# EAGLE design AST2002 (EAGLE 6.3)
DATABASE: ./../../../../../Components/TinyCircuits_Part_Database.txt
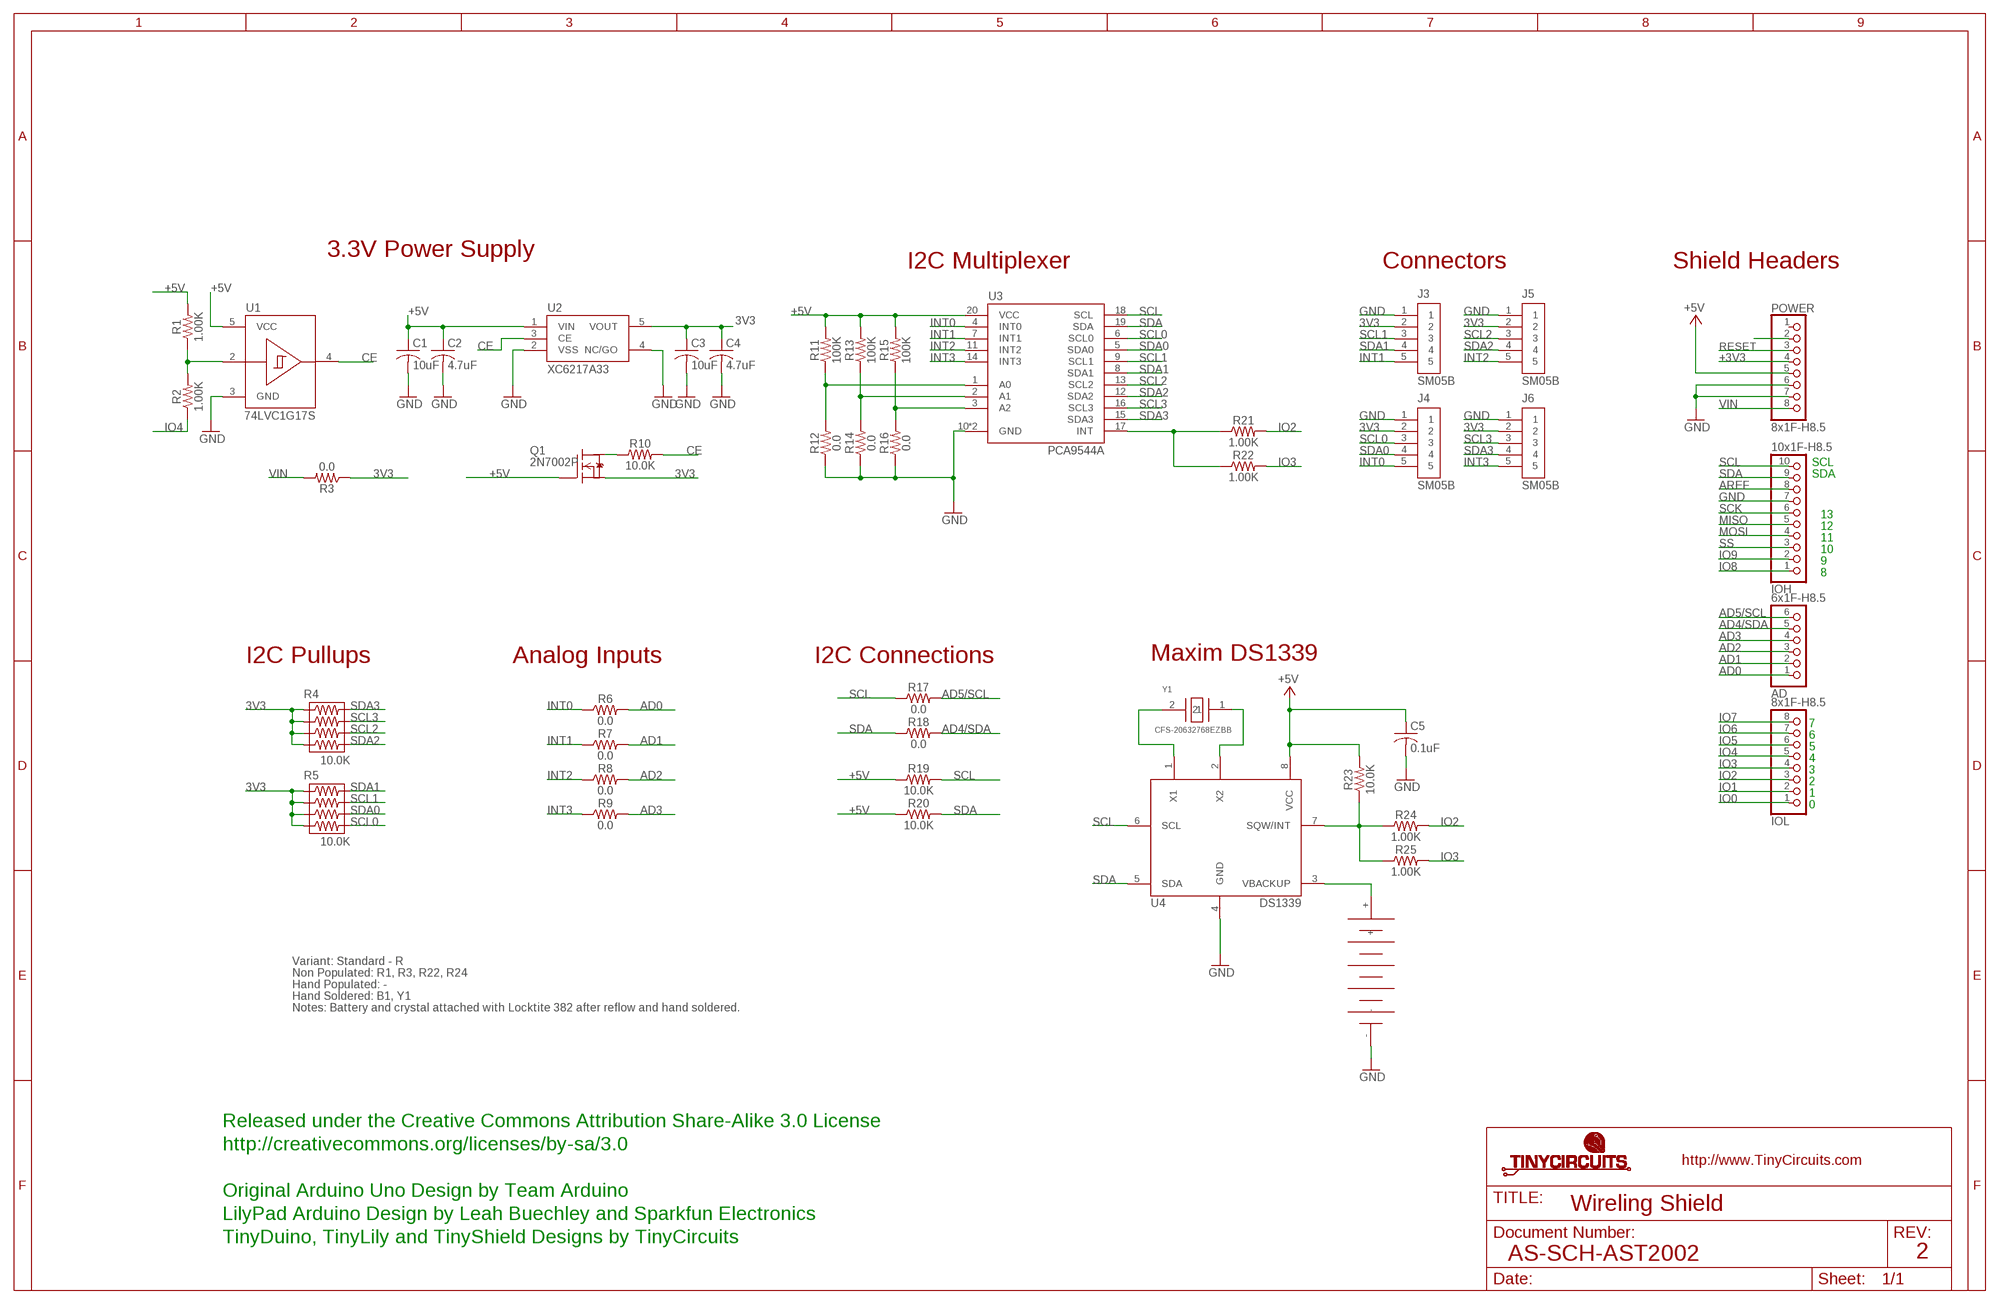
[diagram p0: schematic, sheet 1]

## Parts
AD  6x1F-H8.5  PINHD-1X6  [1X06]
B1  ML-920S/DN  AS-ITM-00182  [ML-920S/DN]
C1  10uF  AS-ITM-00002  [C0603]
C2  4.7uF  AS-ITM-00242  [C0402]
C3  10uF  AS-ITM-00002  [C0603]
C4  4.7uF  AS-ITM-00242  [C0402]
C5  0.1uF  AS-ITM-00008  [C0402]
IOH  10x1F-H8.5  PINHD-1X10_ARD  [1X10]
IOL  8x1F-H8.5  PINHD-1X8  [1X08]
J3  SM05B  AS-ITM-00340  [JST_SH_5X1]
J4  SM05B  AS-ITM-00340  [JST_SH_5X1]
J5  SM05B  AS-ITM-00340  [JST_SH_5X1]
J6  SM05B  AS-ITM-00340  [JST_SH_5X1]
POWER  8x1F-H8.5  PINHD-1X8  [1X08]
Q1  2N7002P  AS-ITM-00110  [SOT-416]
R1  1.00K  AS-ITM-00003  [0402]
R2  1.00K  AS-ITM-00003  [0402]
R3  0.0  AS-ITM-00076  [0402]
R4  10.0K  AS-ITM-00520  [0402RPACK]
R5  10.0K  AS-ITM-00520  [0402RPACK]
R6  0.0  AS-ITM-00076  [0402]
R7  0.0  AS-ITM-00076  [0402]
R8  0.0  AS-ITM-00076  [0402]
R9  0.0  AS-ITM-00076  [0402]
R10  10.0K  AS-ITM-00032  [0402]
R11  100K  AS-ITM-00004  [0402]
R12  0.0  AS-ITM-00076  [0402]
R13  100K  AS-ITM-00004  [0402]
R14  0.0  AS-ITM-00076  [0402]
R15  100K  AS-ITM-00004  [0402]
R16  0.0  AS-ITM-00076  [0402]
R17  0.0  AS-ITM-00076  [0402]
R18  0.0  AS-ITM-00076  [0402]
R19  10.0K  AS-ITM-00032  [0402]
R20  10.0K  AS-ITM-00032  [0402]
R21  1.00K  AS-ITM-00003  [0402]
R22  1.00K  AS-ITM-00003  [0402]
R23  10.0K  AS-ITM-00032  [0402]
R24  1.00K  AS-ITM-00003  [0402]
R25  1.00K  AS-ITM-00003  [0402]
U1  74LVC1G17S  AS-ITM-00382  [SOT-353]
U2  XC6217A33  AS-ITM-00249  [SOT-25]
U3  PCA9544A  AS-ITM-00342  [VQFN-20_4.5X3.5]
U4  DS1339  AS-ITM-00181  [8-USOP]
Y1  CFS-20632768EZBB  AS-ITM-00348  [CRYSTAL_1.9MM_TH]

## Nets
3V3: C3.1 C4.1 J3.2 J4.2 J5.2 J6.2 Q1.2(S) R3.1 R4.1 R4.3 R4.5 R4.7 R5.1 R5.3 R5.5 R5.7 U2.5(VOUT)
+3V3: POWER.4
+5V: C1.1 C2.1 C5.1 POWER.5 Q1.1(G) R1.2 R11.2 R13.2 R15.2 R19.1 R20.1 R23.2 U1.5(VCC) U2.1(VIN) U3.20(VCC) U4.8(VCC)
AD0: AD.1 R6.2
AD1: AD.2 R7.2
AD2: AD.3 R8.2
AD3: AD.4 R9.2
AD4/SDA: AD.5 R18.2
AD5/SCL: AD.6 R17.2
AREF [aref]: IOH.8
CE: R10.2 U1.4(Y) U2.3(CE)
GND: B1.- C1.2 C2.2 C3.2 C4.2 C5.2 IOH.7 J3.1 J4.1 J5.1 J6.1 POWER.6 POWER.7 R12.1 R14.1 R16.1 U1.3(GND) U2.2(VSS) U2.4(NC/GO) U3.10(GND) U3.PAD(GND) U4.4(GND)
INT0: J4.5 R6.1 U3.4(INT0)
INT1: J3.5 R7.1 U3.7(INT1)
INT2: J5.5 R8.1 U3.11(INT2)
INT3: J6.5 R9.1 U3.14(INT3)
IO0: IOL.1
IO1: IOL.2
IO2: IOL.3 R21.2 R24.2
IO3: IOL.4 R22.2 R25.2
IO4: IOL.5 R2.1
IO5: IOL.6
IO6: IOL.7
IO7: IOL.8
IO8: IOH.1
IO9: IOH.2
MISO: IOH.5
MOSI: IOH.4
N$1: Q1.3(D) R10.1
N$2: R11.1 R12.2 U3.1(A0)
N$3: R15.1 R16.2 U3.3(A2)
N$4: R21.1 R22.1 U3.17(INT)
N$6: R13.1 R14.2 U3.2(A1)
N$7: R23.1 R24.1 R25.1 U4.7(SQW/INT)
N$9: B1.+ U4.3(VBACKUP)
N$10 [usbvcc]: POWER.2
N$11: U4.1(X1) Y1.2
N$12: U4.2(X2) Y1.1
N$100: R1.1 R2.2 U1.2(A)
RESET: POWER.3
SCK: IOH.6
SCL: IOH.10 R17.1 R19.2 U3.18(SCL) U4.6(SCL)
SCL0: J4.3 R5.8 U3.6(SCL0)
SCL1: J3.3 R5.4 U3.9(SCL1)
SCL2: J5.3 R4.6 U3.13(SCL2)
SCL3: J6.3 R4.4 U3.16(SCL3)
SDA: IOH.9 R18.1 R20.2 U3.19(SDA) U4.5(SDA)
SDA0: J4.4 R5.6 U3.5(SDA0)
SDA1: J3.4 R5.2 U3.8(SDA1)
SDA2: J5.4 R4.8 U3.12(SDA2)
SDA3: J6.4 R4.2 U3.15(SDA3)
SS: IOH.3
VIN [power]: POWER.8 R3.2
Unconnected: POWER.1

## Notes on the sheet
- 3.3V Power Supply
- I2C Multiplexer | Connectors | Shield Headers
- SCL
- SDA
- 13
- 12
- 11
- 10
- 9
- 8
- I2C Pullups | Analog Inputs | I2C Connections | Maxim DS1339
- 7
- 6
- 5
- 4
- 3
- 2
- 1
- 0
- Variant: Standard - R
- Non Populated: R1, R3, R22, R24
- Hand Populated: -
- Hand Soldered: B1, Y1
- Notes: Battery and crystal attached with Locktite 382 after reflow and hand soldered.
- Released under the Creative Commons Attribution Share-Alike 3.0 License
- http://creativecommons.org/licenses/by-sa/3.0
- Original Arduino Uno Design by Team Arduino
- Wireling Shield
- LilyPad Arduino Design by Leah Buechley and Sparkfun Electronics
- TinyDuino, TinyLily and TinyShield Designs by TinyCircuits
- AS-SCH-AST2002 | 2

## Library data of the parts
AD = SmartPrj:PINHD-1X6: PIN HEADER
B1 = tinycircuits:AS-ITM-00182: BATTERY LITH 3V RECHARGE SMD; PARTNO: AS-ITM-00182
C1 C3 = tinycircuits:AS-ITM-00002: CAP CER 10UF 10V 20% X5R 0603; PARTNO: AS-ITM-00002
C2 C4 = tinycircuits:AS-ITM-00242: CAP CER 4.7UF 6.3V 20% X5R 0402; PARTNO: AS-ITM-00242
C5 = tinycircuits:AS-ITM-00008: CAP CER 0.1UF 16V 10% X5R 0402; PARTNO: AS-ITM-00008
IOH = SmartPrj:PINHD-1X10_ARD: PIN HEADER
IOL POWER = SmartPrj:PINHD-1X8: PIN HEADER
J3-J6 = tinycircuits:AS-ITM-00340: CONN HEADER SH 5POS SIDE 1MM TIN; PARTNO: AS-ITM-00340; PNPROTATION: 180
Q1 = tinycircuits:AS-ITM-00110: MOSFET N-CH SGL 60V SOT-416; PARTNO: AS-ITM-00110; PNPROTATION: 270; VALUE: 2N7002PT
R1 R2 R21 R22 R24 R25 = tinycircuits:AS-ITM-00003: RES 1.00K OHM 1/16W 1% 0402; PARTNO: AS-ITM-00003
R3 R12 R14 R16-R18 = tinycircuits:AS-ITM-00076: RES 0.0 OHM 1/16W 1% 0402 SMD; PARTNO: AS-ITM-00076
R4 R5 = tinycircuits:AS-ITM-00520: RES ARRAY 4 RES 10K OHM 0804; PARTNO: AS-ITM-00520; VALUE: 10K
R6-R9 = tinycircuits:AS-ITM-00076: RES 0.0 OHM 1/16W 1% 0402 SMD; PARTNO: AS-ITM-00076; VALUE: SHORT
R10 R19 R20 R23 = tinycircuits:AS-ITM-00032: RES 10.0K OHM 1/16W 1% 0402 SMD; PARTNO: AS-ITM-00032
R11 R13 R15 = tinycircuits:AS-ITM-00004: RES 100K OHM 1/16W 1% 0402; PARTNO: AS-ITM-00004
U1 = tinycircuits:AS-ITM-00382: IC SGL SCHMITT BUFFER SOT353; PARTNO: AS-ITM-00382; PNPROTATION: 0
U2 = tinycircuits:AS-ITM-00249: IC REG LDO 3.3V 0.2A SOT25; PARTNO: AS-ITM-00249; PNPROTATION: 270
U3 = tinycircuits:AS-ITM-00342: IC I2C MUX 4CH BI-DIR 20-VQFN; PARTNO: AS-ITM-00342; PNPROTATION: 0
U4 = tinycircuits:AS-ITM-00181: IC RTC CLK/CALENDAR I2C 8-USOP; PARTNO: AS-ITM-00181
Y1 = tinycircuits:AS-ITM-00348: CRYSTAL 32.7680KHZ 6PF T/H; PARTNO: AS-ITM-00348

## Net classes
1 power: width 0.61 mm, drill 0.61 mm, clearance 0.254 mm
2 gnd: width 0.305 mm, drill 0.559 mm, clearance 0.254 mm
3 usbvcc: width 0.508 mm, drill 0.61 mm, clearance 0.254 mm
4 aref: width 0.406 mm, drill 0.61 mm, clearance 0.254 mm

## Board
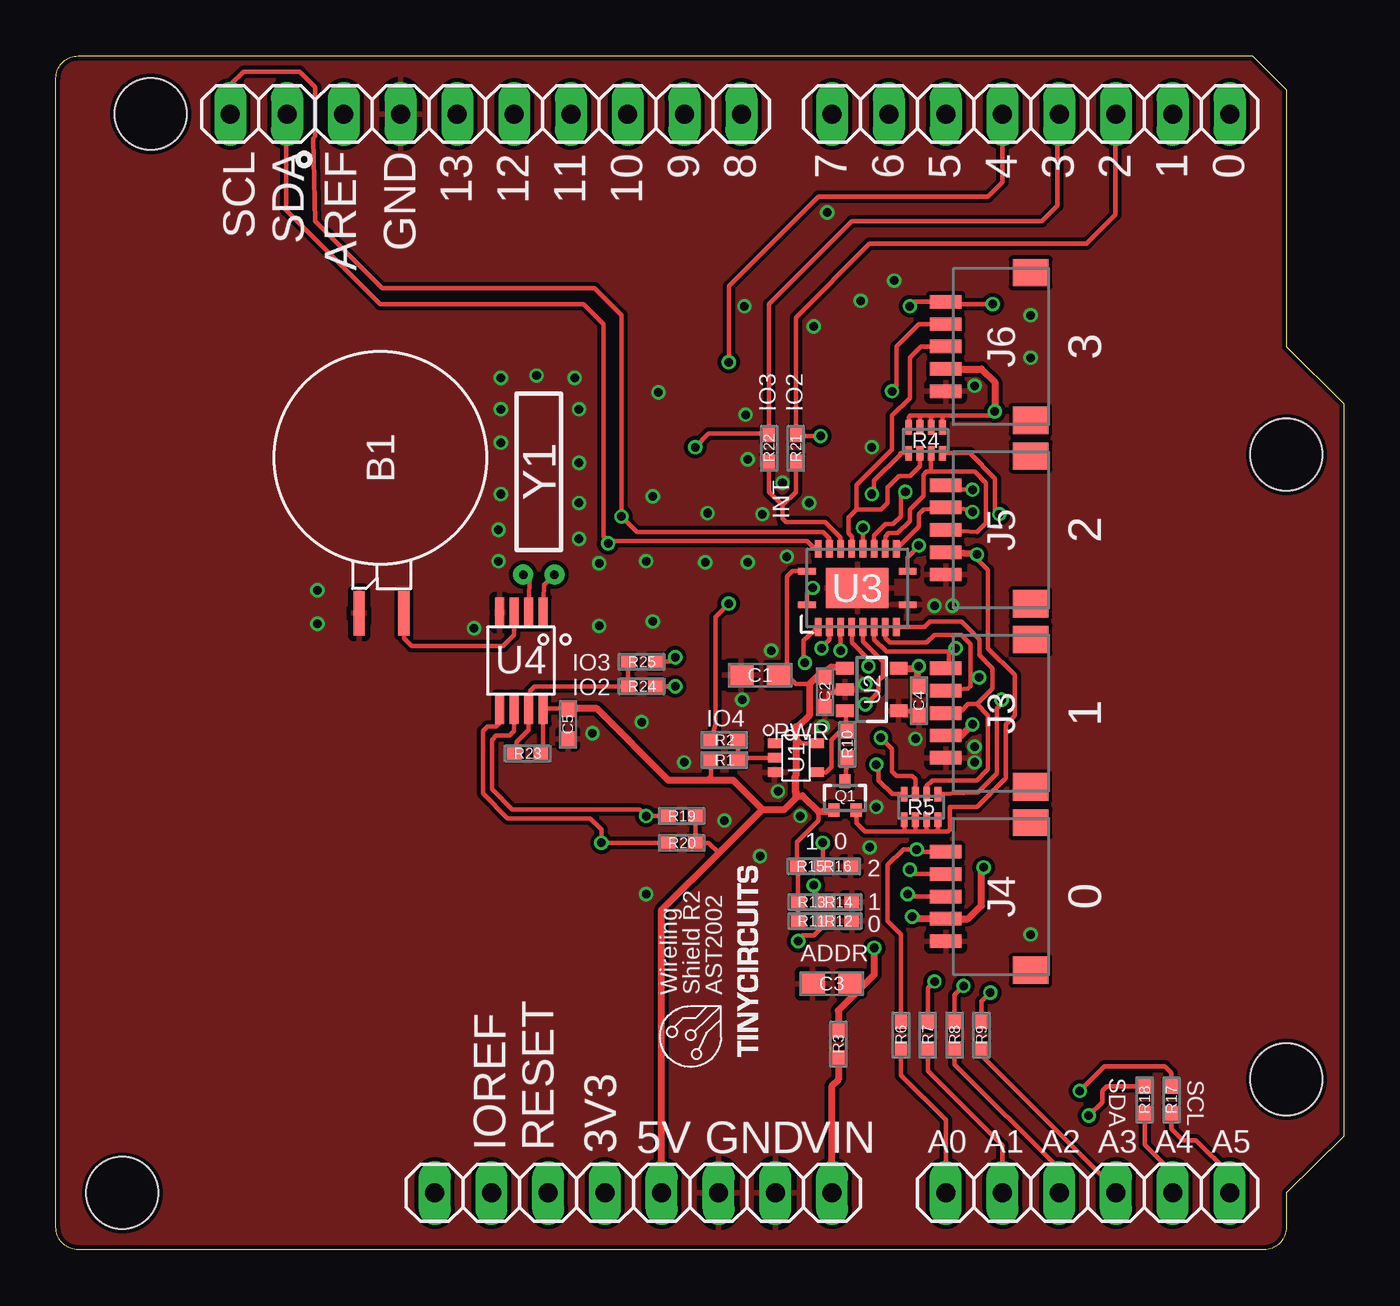
[diagram p1: board, top side]
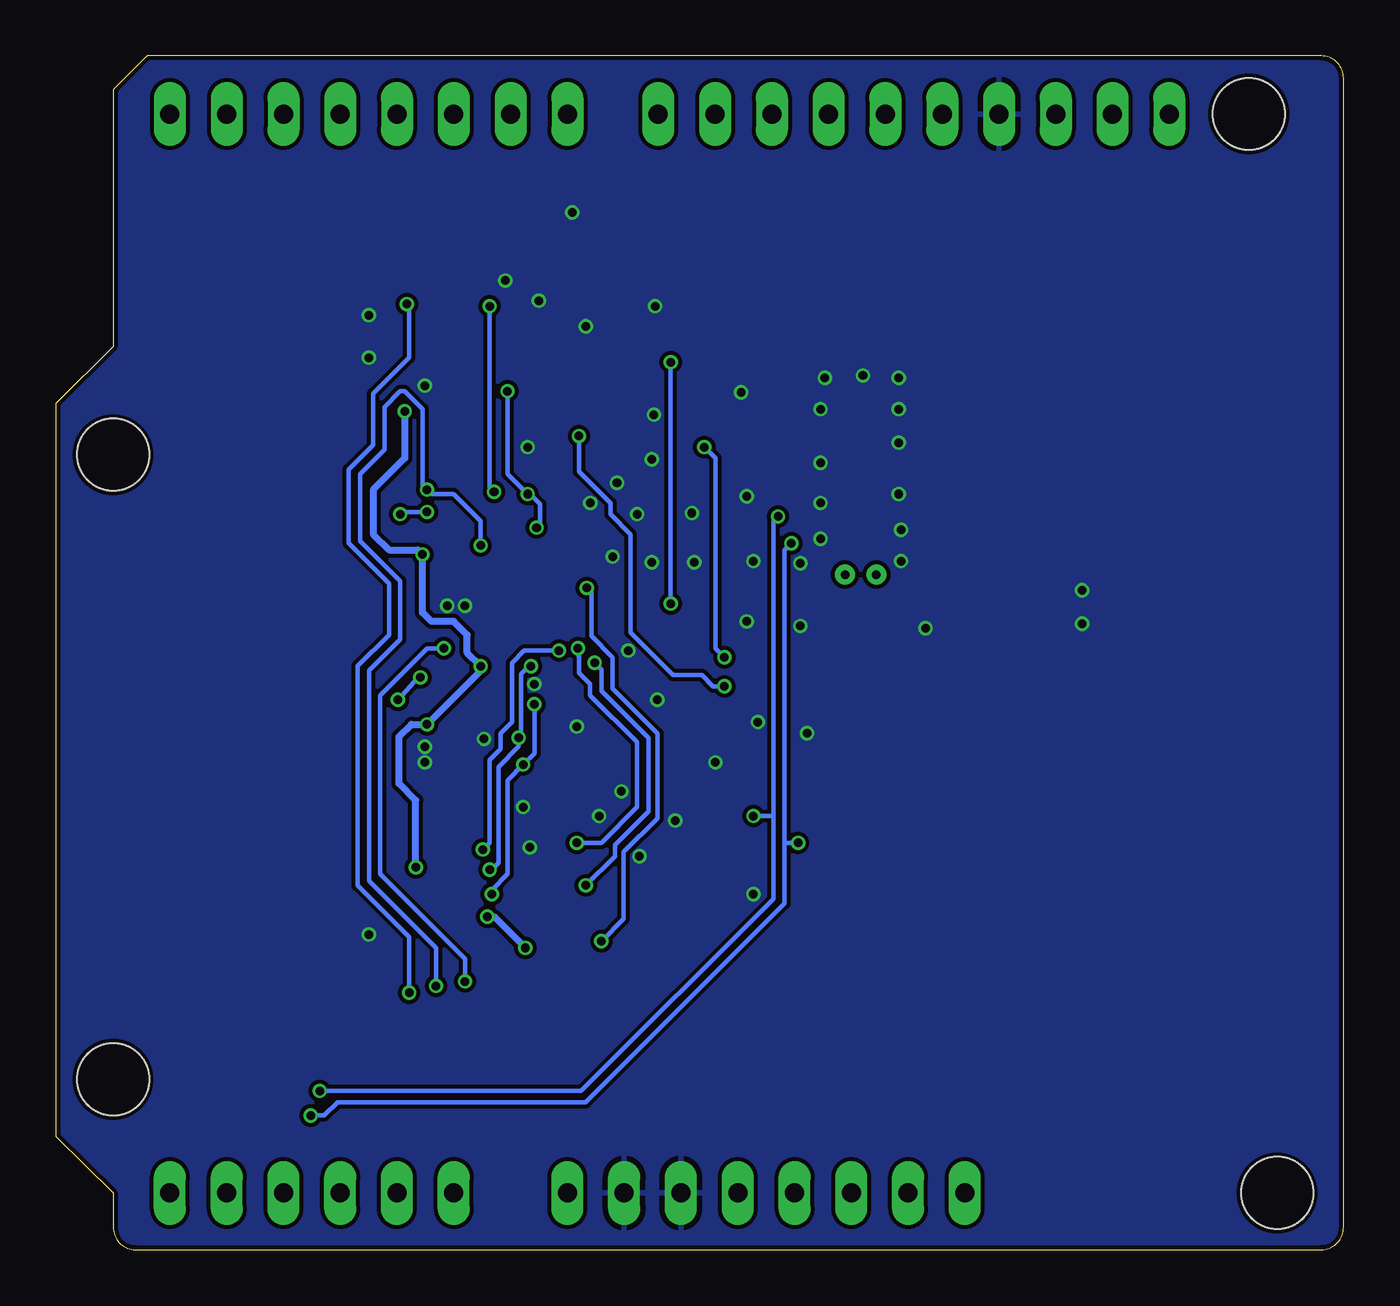
[diagram p2: board, bottom side, seen from below]

Size 57.6 x 53.4 mm. Coordinates in mm from the lower left corner, seen from the top.
Outline: 53.52,53.4 55.04,51.88 55.04,40.39 57.6,37.85 57.6,5.08 55.04,2.54 55.04,1 arc-90 54.04,0 1,0 arc-90 0,1 0,52.4 arc-90 1,53.4 53.52,53.4
Copper layers (1*16): Top 0.035mm / dielectric 1.5mm / Bottom 0.035mm
Design rules "default *": minimum track width 8mil, minimum drill 15mil, track to track 7mil, track to pad 7mil, pad to pad 7mil, via to via 7mil, smd to smd 7mil, copper to edge 8mil, drill to drill 8mil, minimum pad ring 8mil, minimum via ring 5mil, stop-mask expansion 4mil, vias tented up to drill 25mil, thermal gap 10mil
Holes 3.2 mm at 55.04,35.56 55.04,7.62 4.24,50.8 2.97,2.54
tRestrict: 4 lines

### Footprints (pad centres in the part's own frame; a part is rotated, then mirrored left to right if it is on the bottom)
1X06 = drill 0.85 pad 1.422 long: 1 -6.35,0; 2 -3.81,0; 3 -1.27,0; 4 1.27,0; 5 3.81,0; 6 6.35,0
ML-920S/DN = smd 2 x 0.5: + 6.95,1.05; - 6.95,-0.95
C0603 = smd 1.1 x 1: 1 -0.85,0; 2 0.85,0
C0402 = smd 0.65 x 0.6: 1 -0.65,0; 2 0.65,0
1X10@1 = drill 0.85 pad 1.422 long: 1 -11.43,0; 2 -8.89,0; 3 -6.35,0; 4 -3.81,0; 5 -1.27,0; 6 1.27,0; 7 3.81,0; 8 6.35,0; 9 8.89,0; 10 11.43,0
1X08 = drill 0.85 pad 1.422 long: 1 -8.89,0; 2 -6.35,0; 3 -3.81,0; 4 -1.27,0; 5 1.27,0; 6 3.81,0; 7 6.35,0; 8 8.89,0
JST_SH_5X1 = smd 0.6 x 1.4: 1 -2,2.475; 2 -1,2.475; 3 0,2.475; 4 1,2.475; 5 2,2.475 | smd 1.2 x 1.6: PAD1 -3.3,-1.325; PAD2 3.3,-1.325
SOT-416 = smd 0.5 x 0.6: 1 -0.5,-0.65; 2 0.5,-0.65; 3 0,0.65
0402 = smd 0.65 x 0.55: 1 -0.6,0; 2 0.6,0
0402RPACK = smd 0.3 x 0.65: 1 -0.75,0.575; 2 -0.75,-0.575; 3 -0.25,0.575; 4 -0.25,-0.575; 5 0.25,0.575; 6 0.25,-0.575; 7 0.75,0.575; 8 0.75,-0.575
SOT-353 = smd 0.42 x 0.6: 1 -0.65,-0.95; 2 0,-0.95; 3 0.65,-0.95; 4 0.65,0.95; 5 -0.65,0.95
SOT-25 = smd 0.55 x 0.8: 1 -0.95,-1.2; 2 0,-1.2; 3 0.95,-1.2; 4 0.95,1.2; 5 -0.95,1.2
VQFN-20_4.5X3.5 = smd 0.8 x 0.3: 1 -2.25,-0.75; 10 2.25,-0.75; 11 2.25,0.75; 20 -2.25,0.75 | smd 0.3 x 0.8: 2 -1.75,-1.75; 3 -1.25,-1.75; 4 -0.75,-1.75; 5 -0.25,-1.75; 6 0.25,-1.75; 7 0.75,-1.75; 8 1.25,-1.75; 9 1.75,-1.75; 12 1.75,1.75; 13 1.25,1.75; 14 0.75,1.75; 15 0.25,1.75; 16 -0.25,1.75; 17 -0.75,1.75; 18 -1.25,1.75; 19 -1.75,1.75 | smd 2.8 x 1.8: PAD 0,0
8-USOP = smd 0.4 x 1.35: 1 -1,-2.1; 2 -0.35,-2.1; 3 0.3,-2.1; 4 0.95,-2.1; 5 0.95,2.2; 6 0.3,2.2; 7 -0.35,2.2; 8 -1,2.2
CRYSTAL_1.9MM_TH = drill 0.381 pad 0.889: 1 -0.7,0; 2 0.7,0

### Placement (x,y rotation side)
AD  46.15,2.54 0 top
B1  14.52,35.42 270 top
C1  31.5,25.7 180 top
C2  34.4,24.95 270 top
C3  34.7,11.9 180 top
C4  38.6,24.55 270 top
C5  22.9,23.5 270 top
IOH  10x1F-H8.5  [1X10@1]  19.23,50.8 180 top
IOL  43.61,50.8 180 top
J3  42.27,24 90 top
J4  42.27,15.8 90 top
J5  42.27,32.2 90 top
J6  42.27,40.4 90 top
POWER  25.83,2.54 0 top
Q1  35.3,20.3 0 top
R1  29.9,21.9 180 top
R2  29.9,22.8 0 top
R3  35,9.2 270 top
R4  38.9,36.2 0 top
R5  38.7,19.8 180 top
R6  37.8,9.6 270 top
R7  39,9.6 270 top
R8  40.2,9.6 270 top
R9  41.4,9.6 270 top
R10  35.4,22.6 90 top
R11  33.8,14.7 180 top
R12  35,14.7 180 top
R13  33.8,15.55 180 top
R14  35,15.55 180 top
R15  33.75,17.15 180 top
R16  34.95,17.15 180 top
R17  49.9,6.7 270 top
R18  48.7,6.7 270 top
R19  28,19.4 180 top
R20  28,18.2 180 top
R21  33.1,35.85 90 top
R22  31.9,35.85 90 top
R23  21.1,22.2 0 top
R24  26.2,25.2 0 top
R25  26.2,26.3 0 top
U1  33.1,22 270 top
U2  36.5,25.06 270 top
U3  35.85,29.6 0 top
U4  20.8,26.4 180 top
U$1  [DOCFIELD-TINYCIRCUITS-PCB]  78,-4 0 top  (outside the outline)
Y1  21.6,30.2 0 top

### Tracks (layer width: path | path; a pad name or v marks a point on that pad's centre or on a via)
3V3  (via drill 0.38)
  Top 0.203: 37.95,18.75 38,18.7 38.5,18.7 | 38.5,18.7 38.9,18.7 | 38.9,18.7 39.5,18.7 | R5.5 38.45,18.75 38.5,18.7 | R5.3 38.95,18.75 38.9,18.7 | R5.1 39.45,18.75 39.5,18.7 | 39.5,18.7 39.9,18.7 40,18.8 40,19.8 41.2,19.8 42.5,21.1 42.5,23.5 42.9,23.9 42.9,25.7 41.7,26.9 41.7,30.4 41.2,30.9 v41.2,31.1 | R4.7 39.65,37.25 39.6,37.3 | 39.6,37.3 39.1,37.3 | 39.1,37.3 38.7,37.3 | 38.7,37.3 38.2,37.3 38.15,37.25 R4.1 | R4.5 39.15,37.25 39.1,37.3 | R4.3 38.65,37.25 38.7,37.3 | 39.6,37.3 41.8,37.3 v42,37.5 | 37.95,18.75 37.9,18.7 36.2,18.7 35.8,19.1 Q1.2 | 37.95,18.75 R5.7 | C3.1 35.85,11.9 35.85,11.55
  Top 0.305: v41.2,31.1 J5.2 | J6.2 41.4,39.4 42,38.8 v42,37.5 | U2.5 38.51,26.01 v38.6,26.1 38.5,25.3 C4.1 | v41,23.5 40.5,23 J3.2 | v41.5,17.1 41.4,17 41.4,15.4 40.8,14.8 J4.2 38.4,14.8 v38.3,14.9 | v36.6,13.5 36.6,12.3 35.85,11.55 35,10.7 R3.1
  Bottom 0.305: v42,37.5 42,35.4 43.4,34 43.4,32 42.7,31.3 41.4,31.3 v41.2,31.1 41.2,28.5 40.8,28.1 39.8,28.1 39.2,27.5 39.2,26.7 v38.6,26.1 38.5,26 v41,23.5 41.7,23.5 42.25,22.95 42.25,20.85 41.5,20.1 v41.5,17.1 | v38.3,14.9 38,14.9 v36.6,13.5
+5V
  Top 0.203: U3.20 32.95,30.35 32.7,30.1 32.7,25.7 | R11.2 R13.2 33.2,17.1 R15.2 33.15,18.25 34.1,19.2 34.1,19.6 | R19.1 R20.1 29.2,18.2 29.65,17.75 | R23.2 21.8,22.3 U4.8 22.55,24.2 C5.1 | R1.2 29.3,21.2 29.1,21 | 32.7,25.7 33.1,25.3 33.7,25.3 | U1.5 33.35,22.65 33.1,22.9 | C1.1 32.7,25.7
  Top 0.305: U2.1 34.66,26.06 34.5,25.9 C2.1 34,25.6 33.7,25.3 33.7,23.9 33.15,23.35 33.1,23.4 33.1,22.9 33.1,21.2 33.07,21.17 | 33.07,21.17 33.1,20.3 33.4,20.3 34.1,19.6 34.75,19.6 Q1.1 | POWER.5 27.1,15.2 29.65,17.75 31.6,19.7 | 31.6,19.7 30.3,21 29.1,21 27.4,21 24.2,24.2 22.95,24.2 C5.1 | 31.6,19.7 32.6,19.7 33.1,20.2 33.07,21.17
AD0
  Top 0.203: AD.1 39.8,5.8 37.8,7.8 R6.2
AD1
  Top 0.203: AD.2 42.34,4.66 39,8 R7.2
AD2
  Top 0.203: AD.3 44.88,3.62 40.2,8.3 R8.2
AD3
  Top 0.203: AD.4 47.06,3.04 41.4,8.7 R9.2
AD4/SDA
  Top 0.203: AD.5 49.96,3.44 48.7,4.7 R18.2
AD5/SCL
  Top 0.203: AD.6 52.5,3.4 51,4.9 50.4,4.9 49.9,5.4 R17.2
CE
  Top 0.203: U2.3 R10.2 35.1,23.2 34.7,22.8 34.7,21.6 34.45,21.35 U1.4
GND  (via drill 0.38)
  Top 0.203: U2.4 38.04,24.16 38.1,24.1 38.4,24.05 C4.2 | C2.2 34.55,24.45 34.55,24.9 34.8,24.9 34.96,25.06 U2.2
  other vias: 26.95,38.35 37.5,43.35 36,42.45 31.5,17.6 41.1,22.5 36.2,25.3 41.1,21.8 38.45,22.85 39.3,28.8 40.1,28.8 34.3,23.4 41.1,38.65 36.4,18 28.1,21.8 29.9,19.2 26.4,15.9 26.2,23.6 26.7,28.1 30.7,24.6 32,26.8 32.7,31 26.4,30.8 24.3,30.7 24.3,27.9 26.7,33.7 31.6,32.9 33.7,33.4 36.5,35.9 33.9,41.3 32.5,34.3 30.8,42.2 23.4,31.8 34.5,46.4 43.6,41.8 43.6,39.9 43.6,14.1 30.95,35.35 23.4,33.4 23.4,35.2 23.4,37.6 23.2,39 21.5,39.1 19.9,39 19.9,37.6 19.9,36.1 19.9,33.8 19.8,32.2 19.8,30.8 18.7,27.8 24,23.1 30.85,37.35 29.15,32.95 29.05,30.75 30.95,30.75 11.7,29.5 11.7,28 32.3,20.5 33.3,19.4 36.7,19.8
  pour Bottom (rank 2): 0.04,53.3 57.29,53.3 57.64,53.25 57.44,0.04 0.29,0.04 0.04,0.29
  pour Top (rank 2): 0.04,53.3 57.64,53.3 57.44,0.04 0.04,0.04 0.01,30.38 0.04,46.26
INT0  (via drill 0.38)
  Top 0.203: v35.1,26.8 U3.4 | J4.5 38.6,17.8 v38.5,17.9 37.9,17.9 37.2,17.2 37.2,14.7 37.8,14.1 R6.1
  Bottom 0.203: v35.1,26.8 36.65,26.8 37.2,26.25 37.2,23.6 37.7,23.1 37.7,22.4 38.2,21.9 38.2,18.2 v38.5,17.9
INT1  (via drill 0.38)
  Top 0.203: U3.7 36.6,27.3 37.15,26.75 40.05,26.75 | J3.5 39.95,26.25 39.95,26.65 40.05,26.75 | 40.05,26.75 40.2,26.9 v40.25,26.9 40.05,26.75 | R7.1 39,11.7 v39.3,12
  Bottom 0.203: v40.25,26.9 41,26.9 43.1,24.8 43.1,16.8 39.3,13 v39.3,12
INT2  (via drill 0.38)
  Top 0.203: U3.11 38.1,30.95 v38.6,31.5 | v41,34 39.9,34 J5.5 | R8.1 40.2,11.4 v40.6,11.8
  Bottom 0.203: v38.6,31.5 38.6,32.6 39.8,33.8 40.8,33.8 v41,34 41.2,34.2 41.2,37.6 42,38.4 42.2,38.4 42.9,37.7 42.9,35.8 44,34.7 44,31.7 42.2,29.9 42.2,27.3 43.6,25.9 43.6,16.5 40.6,13.5 v40.6,11.8
INT3  (via drill 0.38)
  Top 0.203: U3.14 36.6,31.95 37.1,32.45 37.45,32.45 37.8,32.8 37.8,33.7 v38,33.9 | v38.2,42.2 38.4,42.4 J6.5 39.9,42.3 v41.9,42.3 | R9.1 41.4,11.1 v41.8,11.5
  Bottom 0.203: v38.2,42.2 38.2,34.1 v38,33.9 | v41.8,11.5 41.8,14 44.1,16.3 44.1,26.1 42.7,27.5 42.7,29.8 44.5,31.6 44.5,34.9 43.4,36 43.4,38.3 41.8,39.9 41.8,42.2 v41.9,42.3
IO2  (via drill 0.38)
  Top 0.203: IOL.3 47.4,50.78 47.4,46.3 46.1,45 36.4,45 33.1,41.7 R21.2 33.15,36.4 v34.2,36.4 | R24.2 v27.7,25.2
  Bottom 0.203: v27.7,25.2 28.2,25.2 28.7,25.7 30,25.7 31.9,27.6 31.9,32 32.8,32.9 32.8,33.4 34.2,34.8 v34.2,36.4
IO3  (via drill 0.38)
  Top 0.203: IOL.4 44.8,50.72 44.8,46.7 44.1,46 35.6,46 31.9,42.3 R22.2 31.85,36.5 29.2,36.5 v28.6,35.9 | R25.2 27.5,26.3 v27.7,26.5
  Bottom 0.203: v27.7,26.5 28.1,26.9 28.1,35.4 v28.6,35.9
IO4  (via drill 0.38)
  Top 0.203: IOL.5 42.34,47.74 41.7,47.1 34.1,47.1 30.1,43.1 v30.1,39.7 | R2.1 29.5,23.5 29.5,28.3 v30.1,28.9
  Bottom 0.203: v30.1,28.9 v30.1,39.7
N$1
  Top 0.203: R10.1 Q1.3
N$2  (via drill 0.38)
  Top 0.203: U3.1 33.6,29.35 v33.85,29.6 | v33.2,13.8 33.4,14.05 33.9,14.05 34.4,14.55 R11.1
  Bottom 0.203: v33.85,29.6 33.65,29.45 33.65,27.45 32.7,26.5 32.7,25.1 30.7,23.1 30.7,19.3 32.2,17.8 32.2,14.8 v33.2,13.8 33.3,13.9
N$3  (via drill 0.38)
  Top 0.203: U3.3 34.6,27.3 34.4,27.1 34.4,27.05 v34.25,26.9 | v34.3,18.2 34.3,17.5 34.35,17.45 R15.1
  Bottom 0.203: v34.25,26.9 34.25,26.6 34.2,26.55 34.2,25.8 33.7,25.3 33.7,24.8 31.6,22.7 31.6,20.9 31.6,19.8 33.2,18.2 v34.3,18.2
N$4
  Top 0.203: U3.17 35.1,31.85 34.4,32.55 32.65,32.55 32.5,32.7 32.5,33.3 | 32.5,33.3 33.1,33.9 R21.1 | R22.1 31.9,33.9 32.5,33.3
N$6  (via drill 0.38)
  Top 0.203: U3.2 33.45,27.25 33.45,26.3 v33.5,26.25 | v33.9,16.3 33.85,16.1 R13.1
  Bottom 0.203: v33.9,16.3 32.6,17.6 32.6,18.1 31.1,19.6 31.1,22.9 33.2,25 33.2,25.95 v33.5,26.25
N$7
  Top 0.203: R23.1 20.6,22.3 20.6,22.7 21.15,23.25 U4.7 21.2,24.25 21.2,25 21.4,25.2 R24.1 R25.1
N$9
  Top 0.203: B1.+ 15.57,27.33 15.9,27 20,27 20.5,27.5 U4.3
N$11
  Top 0.203: U4.1 21.84,29.74 Y1.2
N$12
  Top 0.203: U4.2 21.19,29.91 Y1.1
N$100
  Top 0.203: U1.2 30.6,22 R1.1 R2.2
SCL  (via drill 0.38)
  Top 0.203: IOH.10 7.8,52.1 8.4,52.7 10.9,52.7 11.6,52 11.6,49.8 11.5,49.7 11.6,46 14.6,43 24.1,43 25.3,41.8 v25.3,32.8 26,32.1 34.3,32.1 34.6,31.8 U3.18 | R19.2 v26.4,19.4 26.1,19.7 20.4,19.7 19.5,20.6 19.5,22.8 19.7,23 20.3,23 20.5,23.2 U4.6 | R17.1 49.9,7.9 49.6,8.2 46.9,8.2 v45.8,7.1
  Bottom 0.203: v45.8,7.1 34.1,7.1 25.5,15.7 25.5,19.4 | 25.5,19.4 25.5,32.6 v25.3,32.8 | v26.4,19.4 25.5,19.4
SCL0  (via drill 0.38)
  Top 0.203: U3.6 36.1,27.2 37,26.3 37,25.65 36.8,25.45 36.8,24.95 36.4,24.55 v36.2,24.4 | v38.1,15.9 38.2,15.8 J4.3 | v36.7,21.7 36.8,21.6 36.8,21 37.42,20.38 R5.8
  Bottom 0.203: v36.2,24.4 36.2,22.2 v36.7,21.7 37.4,21 37.4,16.8 38.1,16.1 v38.1,15.9
SCL1
  Top 0.203: U3.9 38.85,27.85 39.1,28.1 40.5,28.1 41.3,27.3 41.3,26.6 41.9,26 41.9,25.1 41.2,24.4 | J3.3 40.5,24.1 40.8,24.4 41.2,24.4 | 41.2,24.4 41.7,23.9 41.7,21.5 41.2,21 39.2,21 38.95,20.75 R5.4
SCL2
  Top 0.203: U3.13 37.1,31.9 37.25,32.05 37.65,32.05 38.2,32.6 38.2,33.1 38.8,33.7 38.8,34.65 38.95,34.8 39.15,34.8 | J5.3 41.2,32.1 41.6,32.5 41.6,34.3 41.1,34.8 39.15,34.8 | R4.6 39.15,34.8
SCL3
  Top 0.203: U3.16 35.6,31.9 35.45,32.05 35.45,32.75 35.8,33.1 | R4.4 38.65,35.05 38.2,34.6 37.7,34.6 37.2,34.1 37.2,33.4 36.9,33.1 35.8,33.1 | J6.3 38.7,40.4 38.2,39.9 38.2,38.1 37.4,37.3 37.4,35.8 35.8,34.2 35.8,33.1
SDA  (via drill 0.38)
  Top 0.203: IOH.9 10.3,50.76 10.3,46.5 14.5,42.3 23.6,42.3 24.5,41.4 24.5,31.9 24.7,31.7 24.8,31.7 | R20.2 v24.4,18.2 24.4,18.8 23.9,19.3 20.2,19.3 19.1,20.4 19.1,23.2 19.3,23.4 19.7,23.4 19.85,23.55 U4.5 | U3.19 33.95,31.35 33.6,31.7 24.8,31.7 | R18.1 47,7.3 46.8,7.1 46.8,6.6 v46.2,6 | 24.8,31.7 v24.7,31.6
  Bottom 0.203: 25,18.2 25,15.5 33.9,6.6 45,6.6 45.6,6 v46.2,6 | 25,18.2 25,31.3 v24.7,31.6 | v24.4,18.2 25,18.2
SDA0  (via drill 0.38)
  Top 0.203: U3.5 35.6,27.15 36.4,26.35 36.4,26.15 v36.35,26.1 | v38.2,17 38.4,16.8 J4.4 | R5.6 38.45,21.05 38.3,21.2 37.6,21.2 37.4,21.4 37.4,22.4 v36.9,22.9
  Bottom 0.203: v36.35,26.1 36.35,26 36.55,26 36.8,25.75 36.8,22.7 v36.9,22.9 36.9,22.5 37.8,21.6 37.8,17.3 38.1,17 v38.2,17
SDA1  (via drill 0.38)
  Top 0.203: U3.8 37.1,27.35 37.3,27.15 38.95,27.15 39.3,27.5 40.5,27.5 40.9,27.1 40.9,25.6 | 40.9,25.6 40.9,25.2 40.8,25.1 J3.4 | v42.3,24.6 42.3,24.4 42.1,24.2 42.1,21.3 41.25,20.45 R5.2 | v41.3,25.6 40.9,25.6
  Bottom 0.203: v41.3,25.6 41.4,25.6 v42.3,24.6
SDA2  (via drill 0.38)
  Top 0.203: U3.12 38.6,32.35 38.6,32.9 38.8,33.1 J5.4 40.9,33.1 v41,33 | v42.2,32.9 42,33.1 42,34.5 40.88,35.62 R4.8
  Bottom 0.203: v41,33 42.1,33 v42.2,32.9
SDA3  (via drill 0.38)
  Top 0.203: U3.15 v36.1,32.3 35.95,32.35 | R4.2 37.77,35.62 37.77,35.58 36.6,34.4 36.6,33.9 v36.5,33.8 | J6.4 38.6,41.4 37.6,40.4 37.6,38.6 v37.4,38.4
  Bottom 0.203: v36.1,32.3 36,32.3 35.95,32.35 35.95,33.35 36.4,33.8 v36.5,33.8 37.4,34.7 v37.4,38.4
VIN
  Top 0.305: R3.2 35,7.6 34.7,7.3 34.7,2.56 POWER.8

### Text on the board
tPlace: SCL | SDA | AREF | GND | 13 | 12 | 11 | 10 | 9 | 8 | 7 | 6 | 5 | 4 | 3 | 2 | 1 | 0 | 3 | IO3 | IO2 | INT | 2 | IO3 | IO2 | 1 | IO4 | PWR | 1 | 0 | 2 | 0 | 1 | 0 | ADDR | Wireling | Shield R2 | AST2002 | SDA | SCL | IOREF | RESET | 3V3 | 5V | GND | VIN | A0 | A1 | A2 | A3 | A4 | A5
Document: FABRICATION DRAWING | NOTES: | 1. PRINTED CIRCUIT BOARD MADE FROM NEMA GRADE FR-4 EPOXY LAMINATE | WITH 1 OUNCE COPPER PLATING AND .024 THICKNESS. | 2. ALL DIMENSIONS ARE GIVEN IN MILLIMETERS. | 3. CIRCUIT PATHS ARE FOR REFERENCE ONLY. | 4. HOLE SIZES SHOWN ARE FINISHED DIAMETERS AFTER PLATING. | 5. BOARD PLATED USING REFLOW OR SIMILAR METHOD. | 6. BOARD TO HAVE BLUE SOLDER MASK ON PLATED SURFACES USING WET FILM | 7. SILKSCREEN BOARD USING WHITE INK. | SR100 OR SR1010 EPOXY. EQUIVALENT WET OR DRY FILM MAY BE USED. | 8. THE FOLLOWING INFORMATION APPLIES TO THIS BOARD: | * 2 COPPER LAYERS | * .024 BOARD THICKNESS | * REQUIRES TOP SIDE SILKSCREEN | Released under the Creative Commons Attribution Share-Alike 3.0 License | http://creativecommons.org/licenses/by-sa/3.0 | Original Arduino Uno Design by Team Arduino | LilyPad Arduino Design by Leah Buechley and Sparkfun Electronics | TinyDuino, TinyLily and TinyShield Designs by TinyCircuits | Wireling Shield | AS-PCB-AST2002 | 2